# Altium schematic sheet [3] CAN, CENR-50M, Flow, Relays, LEDs.SchDoc
size A2; DocumentNumber: 6; SheetNumber: 6; SheetTotal: 10
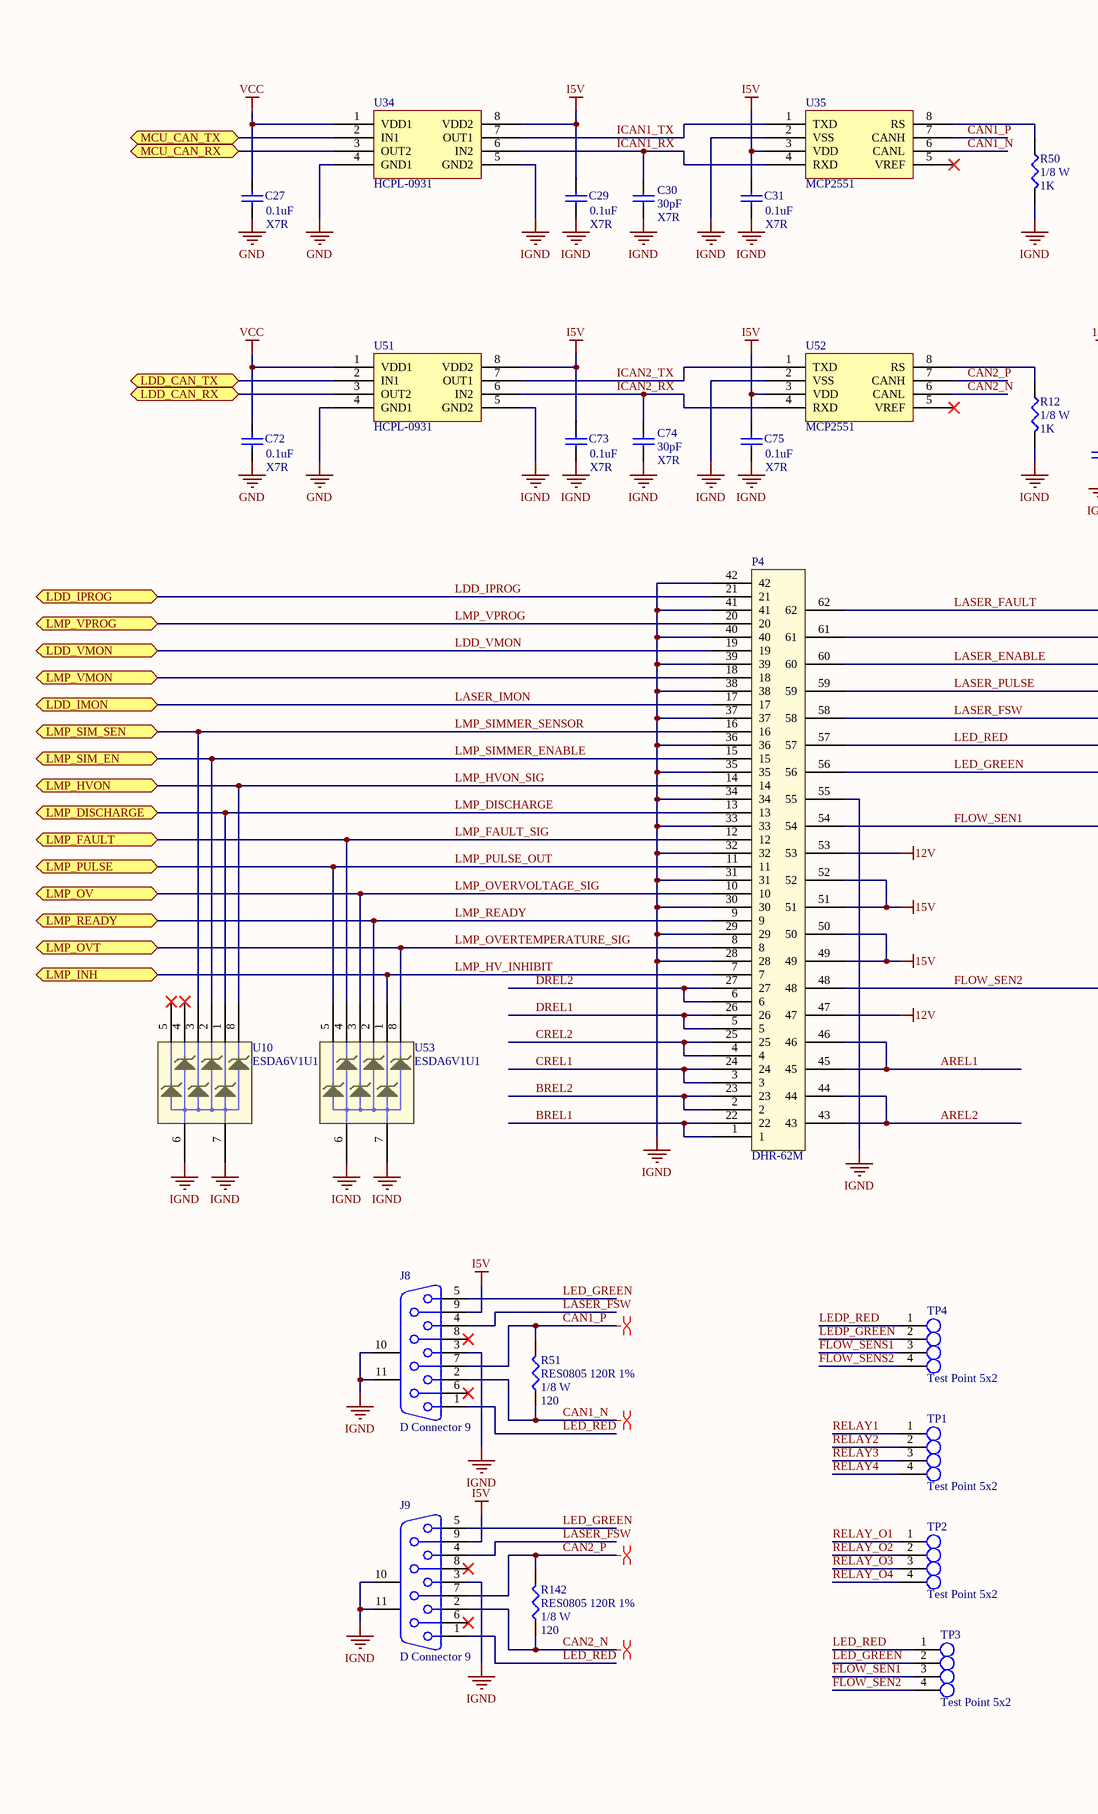
[diagram p0: [3] CAN, CENR-50M, Flow, Relays, LEDs.SchDoc, left]
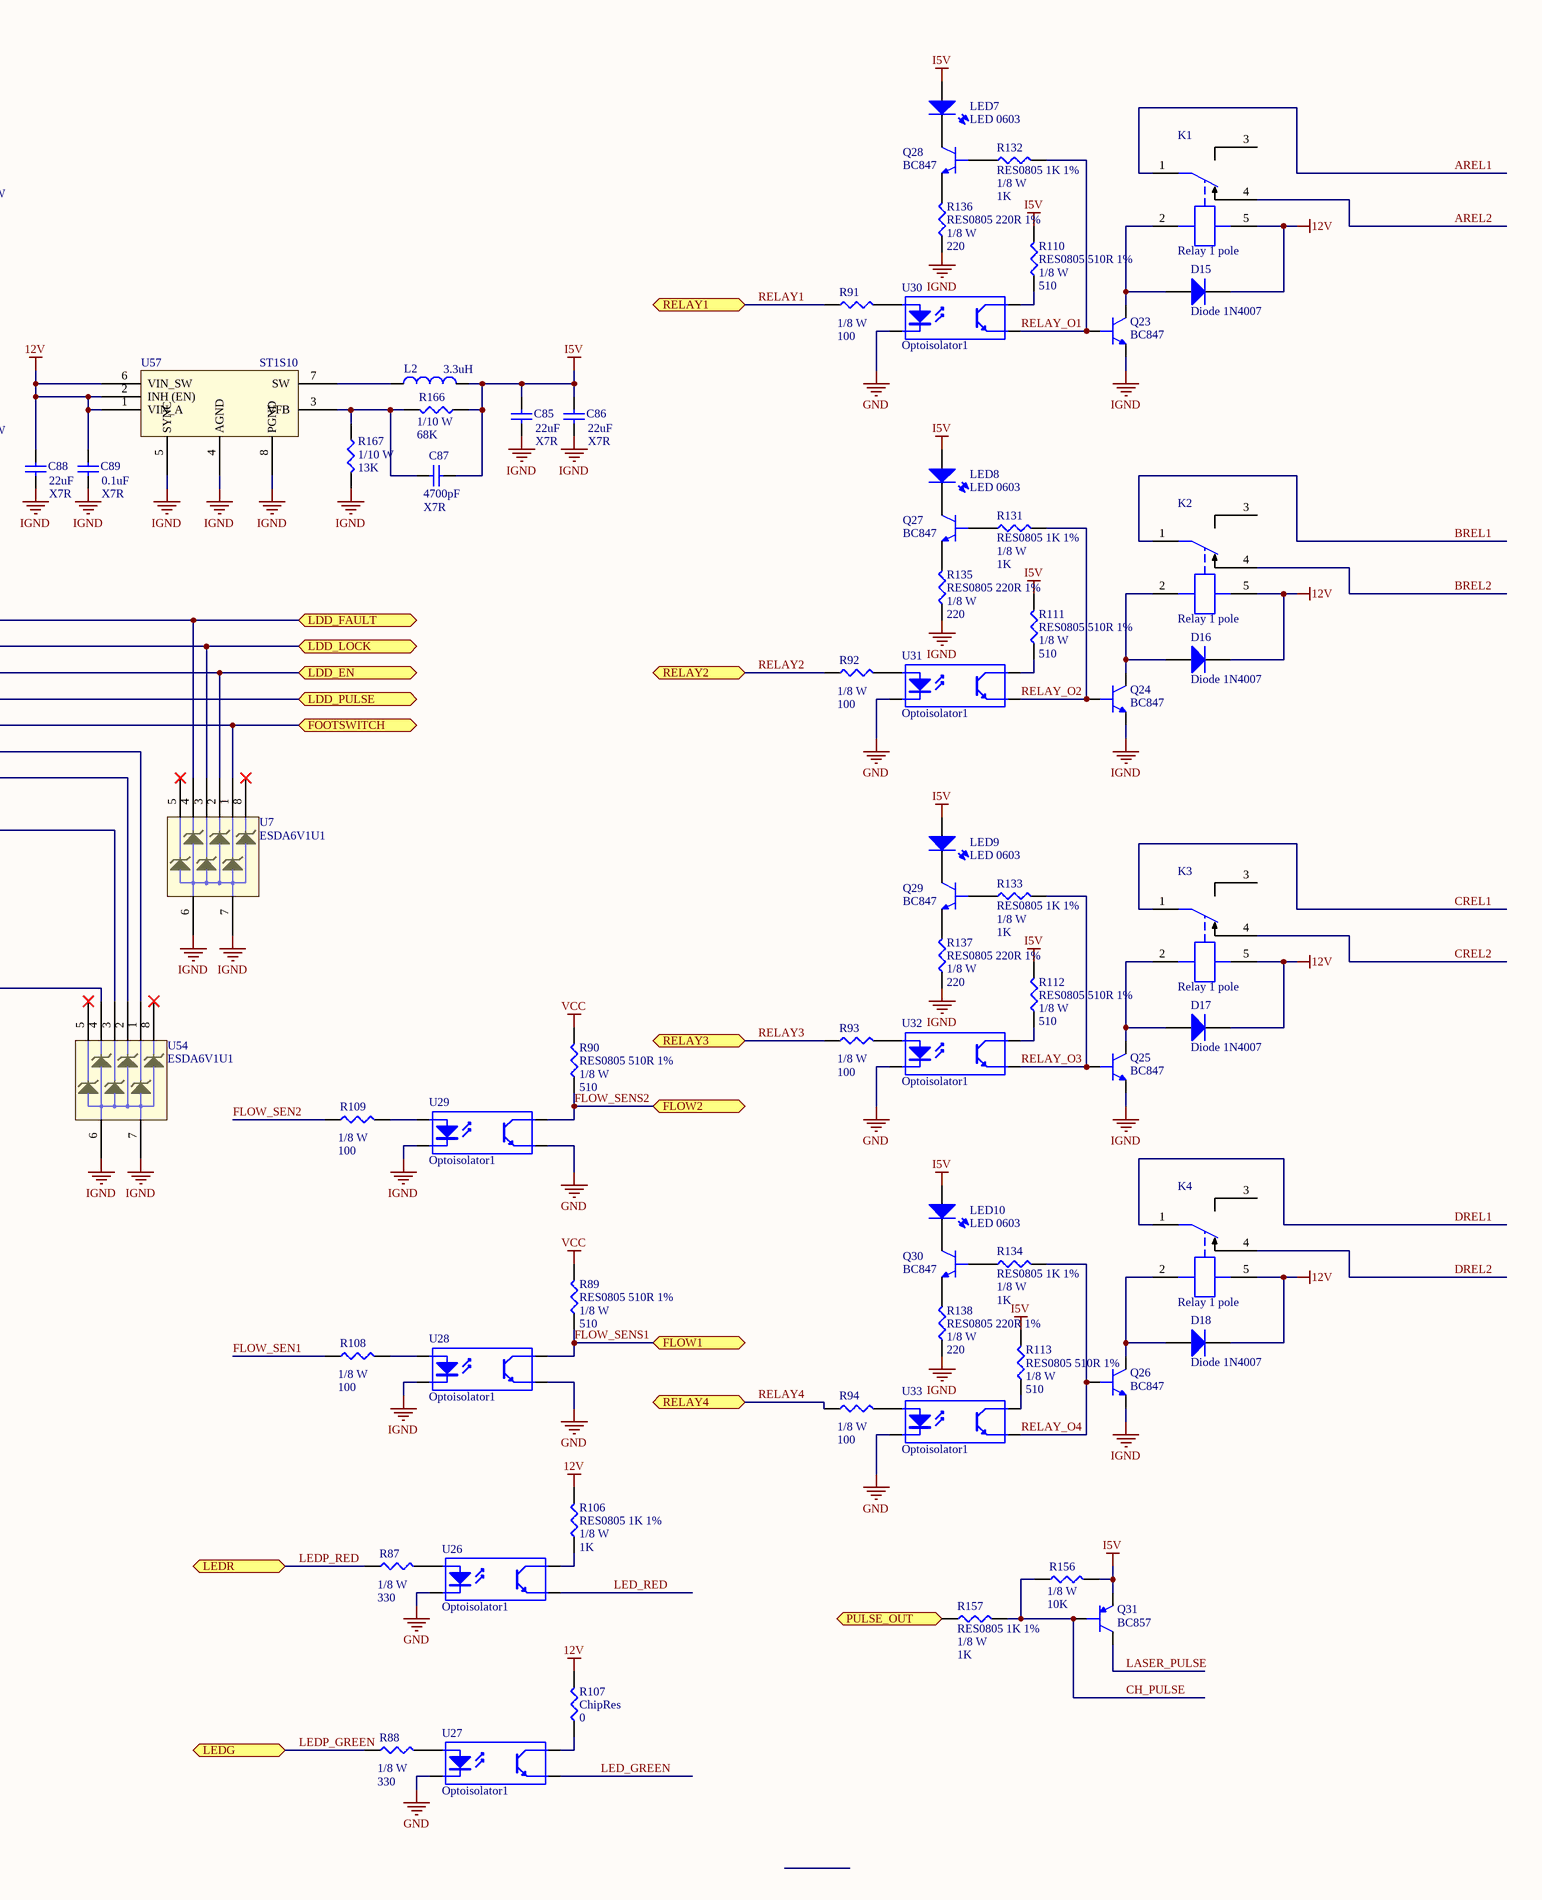
[diagram p1: [3] CAN, CENR-50M, Flow, Relays, LEDs.SchDoc, right]

## Parts
C27  value 0.1uF  Type: X7R  [CAP0805]  (hidden comment: CAP0805 0.1uF X7R)
C29  value 0.1uF  Type: X7R  [CAP0805]  (hidden comment: CAP0805 0.1uF X7R)
C30  value 30pF  Type: X7R  [CAP0805]  (hidden comment: CAP0805 30pF X7R)
C31  value 0.1uF  Type: X7R  [CAP0805]  (hidden comment: CAP0805 0.1uF X7R)
C72  value 0.1uF  Type: X7R  [CAP0805]  (hidden comment: CAP0805 0.1uF X7R)
C73  value 0.1uF  Type: X7R  [CAP0805]  (hidden comment: CAP0805 0.1uF X7R)
C74  value 30pF  Type: X7R  [CAP0805]  (hidden comment: CAP0805 30pF X7R)
C75  value 0.1uF  Type: X7R  [CAP0805]  (hidden comment: CAP0805 0.1uF X7R)
C85  value 22uF  Type: X7R  [CAP1210]  (hidden comment: ChipCap 22u X7R)
C86  value 22uF  Type: X7R  [CAP1210]  (hidden comment: ChipCap 22u X7R)
C87  value 4700pF  Type: X7R  [CAP0603]  (hidden comment: ChipCap 4700 X7R)
C88  value 22uF  Type: X7R  [CAP1210]  (hidden comment: ChipCap 22u X7R)
C89  value 0.1uF  Type: X7R  [CAP0603]  (hidden comment: ChipCap 0.1u X7R)
D15  Diode 1N4007  [DO-41]
D16  Diode 1N4007  [DO-41]
D17  Diode 1N4007  [DO-41]
D18  Diode 1N4007  [DO-41]
J8  D Connector 9  [DSUB1.385-2H9F]
J9  D Connector 9  [DSUB1.385-2H9F]
K1  Relay 1 pole  [G5LA]
K2  Relay 1 pole  [G5LA]
K3  Relay 1 pole  [G5LA]
K4  Relay 1 pole  [G5LA]
L2  value 3.3uH  [SDR0403]  (hidden comment: Inductance)
LED7  LED 0603  [LED 0603]
LED8  LED 0603  [LED 0603]
LED9  LED 0603  [LED 0603]
LED10  LED 0603  [LED 0603]
P4  DHR-62M  [DHR-62M]
Q23  BC847  [SOT23]
Q24  BC847  [SOT23]
Q25  BC847  [SOT23]
Q26  BC847  [SOT23]
Q27  BC847  [SOT23]
Q28  BC847  [SOT23]
Q29  BC847  [SOT23]
Q30  BC847  [SOT23]
Q31  BC857  [SOT23]
R12  value 1K  Rating: 1/8 W  [RES0805]  (hidden comment: RES0805 1K 1%)
R50  value 1K  Rating: 1/8 W  [RES0805]  (hidden comment: RES0805 1K 1%)
R51  RES0805 120R 1%  value 120  Rating: 1/8 W  [RES0805]
R87  value 330  Rating: 1/8 W  [RES0805]  (hidden comment: RES0805 330R 1%)
R88  value 330  Rating: 1/8 W  [RES0805]  (hidden comment: RES0805 330R 1%)
R89  RES0805 510R 1%  value 510  Rating: 1/8 W  [RES0805]
R90  RES0805 510R 1%  value 510  Rating: 1/8 W  [RES0805]
R91  value 100  Rating: 1/8 W  [RES0805]  (hidden comment: RES0805 100R 1%)
R92  value 100  Rating: 1/8 W  [RES0805]  (hidden comment: RES0805 100R 1%)
R93  value 100  Rating: 1/8 W  [RES0805]  (hidden comment: RES0805 100R 1%)
R94  value 100  Rating: 1/8 W  [RES0805]  (hidden comment: RES0805 100R 1%)
R106  RES0805 1K 1%  value 1K  Rating: 1/8 W  [RES0805]
R107  ChipRes  value 0  [RES0805]
R108  value 100  Rating: 1/8 W  [RES0805]  (hidden comment: RES0805 100R 1%)
R109  value 100  Rating: 1/8 W  [RES0805]  (hidden comment: RES0805 100R 1%)
R110  RES0805 510R 1%  value 510  Rating: 1/8 W  [RES0805]
R111  RES0805 510R 1%  value 510  Rating: 1/8 W  [RES0805]
R112  RES0805 510R 1%  value 510  Rating: 1/8 W  [RES0805]
R113  RES0805 510R 1%  value 510  Rating: 1/8 W  [RES0805]
R131  RES0805 1K 1%  value 1K  Rating: 1/8 W  [RES0805]
R132  RES0805 1K 1%  value 1K  Rating: 1/8 W  [RES0805]
R133  RES0805 1K 1%  value 1K  Rating: 1/8 W  [RES0805]
R134  RES0805 1K 1%  value 1K  Rating: 1/8 W  [RES0805]
R135  RES0805 220R 1%  value 220  Rating: 1/8 W  [RES0805]
R136  RES0805 220R 1%  value 220  Rating: 1/8 W  [RES0805]
R137  RES0805 220R 1%  value 220  Rating: 1/8 W  [RES0805]
R138  RES0805 220R 1%  value 220  Rating: 1/8 W  [RES0805]
R142  RES0805 120R 1%  value 120  Rating: 1/8 W  [RES0805]
R156  value 10K  Rating: 1/8 W  [RES0805]  (hidden comment: RES0805 10K 1%)
R157  RES0805 1K 1%  value 1K  Rating: 1/8 W  [RES0805]
R166  value 68K  Rating: 1/10 W  [RES0603]  (hidden comment: ChipRes 68K 1%)
R167  value 13K  Rating: 1/10 W  [RES0603]  (hidden comment: ChipRes 13K 1%)
TP1  Test Point 5x2  [PG-1.5-13.5-4P-2.54PH]
TP2  Test Point 5x2  [PG-1.5-13.5-4P-2.54PH]
TP3  Test Point 5x2  [PG-1.5-13.5-4P-2.54PH]
TP4  Test Point 5x2  [PG-1.5-13.5-4P-2.54PH]
U7  ESDA6V1U1  [SOP8]
U10  ESDA6V1U1  [SOP8]
U26  Optoisolator1  [DIP-4]
U27  Optoisolator1  [DIP-4]
U28  Optoisolator1  [DIP-4]
U29  Optoisolator1  [DIP-4]
U30  Optoisolator1  [DIP-4]
U31  Optoisolator1  [DIP-4]
U32  Optoisolator1  [DIP-4]
U33  Optoisolator1  [DIP-4]
U34  HCPL-0931  [SOIC8]
U35  MCP2551  [SOIC8]
U51  HCPL-0931  [SOIC8]
U52  MCP2551  [SOIC8]
U53  ESDA6V1U1  [SOP8]
U54  ESDA6V1U1  [SOP8]
U57  ST1S10  [SOIC8]

## Ports
FLOW1, FLOW2, FOOTSWITCH, LDD_CAN_RX, LDD_CAN_TX, LDD_EN, LDD_FAULT, LDD_IMON, LDD_IPROG, LDD_LOCK, LDD_PULSE, LDD_VMON, LEDG, LEDR, LMP_DISCHARGE, LMP_FAULT, LMP_HVON, LMP_INH, LMP_OV, LMP_OVT, LMP_PULSE, LMP_READY, LMP_SIM_EN, LMP_SIM_SEN, LMP_VMON, LMP_VPROG, MCU_CAN_RX, MCU_CAN_TX, PULSE_OUT, RELAY1, RELAY2, RELAY3, RELAY4

## Nets
12V: C88.2 C89.2 D15.2(K) D16.2(K) D17.2(K) D18.2(K) K1.5 K2.5 K3.5 K4.5 P4.47 P4.53 R106.2 R107.2 U57.1(VIN_A) U57.2(INH_(EN)) U57.6(VIN_SW)
15V: P4.49 P4.50 P4.51 P4.52
GND: C27.1 C72.1 U26.2(K) U27.2(K) U28.3(E) U29.3(E) U30.2(K) U31.2(K) U32.2(K) U33.2(K) U34.4(GND1) U51.4(GND1)
I5V: C29.2 C31.2 C73.2 C75.2 C85.2 C86.2 C87.2 J8.9 J9.9 L2.1 LED7.2 LED8.2 LED9.2 LED10.2 Q31.2 R110.2 R111.2 R112.2 R113.2 R156.2 R166.1 U34.8(VDD2) U35.3(VDD) U51.8(VDD2) U52.3(VDD)
IGND: C29.1 C30.1 C31.1 C73.1 C74.1 C75.1 C85.1 C86.1 C88.1 C89.1 J8.3 J8.10(MH1) J8.11(MH2) J9.3 J9.10(MH1) J9.11(MH2) P4.28 P4.29 P4.30 P4.31 P4.32 P4.33 P4.34 P4.35 P4.36 P4.37 P4.38 P4.39 P4.40 P4.41 P4.42 P4.55 Q23.2 Q24.2 Q25.2 Q26.2 R12.2 R50.2 R135.1 R136.1 R137.1 R138.1 R167.2 U7.6 U7.7 U10.6 U10.7 U28.2(K) U29.2(K) U34.5(GND2) U35.2(VSS) U51.5(GND2) U52.2(VSS) U53.6 U53.7 U54.6 U54.7 U57.4(AGND) U57.5(SYNC) U57.8(PGND)
VCC: C27.2 C72.2 R89.2 R90.2 U34.1(VDD1) U51.1(VDD1)
AREL1: K1.1 P4.45 P4.46
AREL2: K1.4 P4.43 P4.44
BREL1: K2.1 P4.1 P4.22
BREL2: K2.4 P4.2 P4.23
CAN1_N: J8.2 R51.1 U35.6(CANL)
CAN1_P: J8.7 R51.2 U35.7(CANH)
CAN2_N: J9.2 R142.1 U52.6(CANL)
CAN2_P: J9.7 R142.2 U52.7(CANH)
CH_PULSE: Q31.1 R156.1 R157.2
CREL1: K3.1 P4.3 P4.24
CREL2: K3.4 P4.4 P4.25
DREL1: K4.1 P4.5 P4.26
DREL2: K4.4 P4.6 P4.27
FLOW_SEN1: P4.54 R108.1 TP3.3 U54.3
FLOW_SEN2: P4.48 R109.1 TP3.4 U54.4
FLOW_SENS1: R89.1 TP4.3 U28.4(C) ; port FLOW1
FLOW_SENS2: R90.1 TP4.4 U29.4(C) ; port FLOW2
ICAN1_RX: C30.2 U34.6(IN2) U35.4(RXD)
ICAN1_TX: U34.7(OUT1) U35.1(TXD)
ICAN2_RX: C74.2 U51.6(IN2) U52.4(RXD)
ICAN2_TX: U51.7(OUT1) U52.1(TXD)
LASER_ENABLE: P4.60 U7.2 ; port LDD_EN
LASER_FAULT: P4.62 U7.4 ; port LDD_FAULT
LASER_FSW: J8.4 J9.4 P4.58 U7.1 ; port FOOTSWITCH
LASER_IMON: P4.17 ; port LDD_IMON
LASER_PULSE: P4.59 Q31.3 ; port LDD_PULSE
LDD_CAN_RX: U51.3(OUT2) ; port LDD_CAN_RX
LDD_CAN_TX: U51.2(IN1) ; port LDD_CAN_TX
LDD_IPROG: P4.21 ; port LDD_IPROG
LDD_LOCK: P4.61 U7.3 ; port LDD_LOCK
LDD_VMON: P4.19 ; port LDD_VMON
LED_GREEN: J8.5 J9.5 P4.56 TP3.2 U27.3(E) U54.2
LED_RED: J8.1 J9.1 P4.57 TP3.1 U26.3(E) U54.1
LEDP_GREEN: R88.1 TP4.2 ; port LEDG
LEDP_RED: R87.1 TP4.1 ; port LEDR
LMP_DISCHARGE: P4.13 U10.1 ; port LMP_DISCHARGE
LMP_FAULT_SIG: P4.12 U53.4 ; port LMP_FAULT
LMP_HV_INHIBIT: P4.7 U53.1 ; port LMP_INH
LMP_HVON_SIG: P4.14 U10.8 ; port LMP_HVON
LMP_OVERTEMPERATURE_SIG: P4.8 U53.8 ; port LMP_OVT
LMP_OVERVOLTAGE_SIG: P4.10 U53.3 ; port LMP_OV
LMP_PULSE_OUT: P4.11 U53.5 ; port LMP_PULSE
LMP_READY: P4.9 U53.2 ; port LMP_READY
LMP_SIMMER_ENABLE: P4.15 U10.2 ; port LMP_SIM_EN
LMP_SIMMER_SENSOR: P4.16 U10.3 ; port LMP_SIM_SEN
LMP_VMON: P4.18 ; port LMP_VMON
LMP_VPROG: P4.20 ; port LMP_VPROG
MCU_CAN_RX: U34.3(OUT2) ; port MCU_CAN_RX
MCU_CAN_TX: U34.2(IN1) ; port MCU_CAN_TX
PULSE_OUT: R157.1 ; port PULSE_OUT
RELAY1: R91.1 TP1.1 ; port RELAY1
RELAY2: R92.1 TP1.2 ; port RELAY2
RELAY3: R93.1 TP1.3 ; port RELAY3
RELAY4: R94.1 TP1.4 ; port RELAY4
RELAY_O1: Q23.1 R132.2 TP2.1 U30.3(E)
RELAY_O2: Q24.1 R131.2 TP2.2 U31.3(E)
RELAY_O3: Q25.1 R133.2 TP2.3 U32.3(E)
RELAY_O4: Q26.1 R134.2 TP2.4 U33.3(E)
NetC87_1: C87.1 R166.2 R167.1 U57.3(VFB)
NetD15_1: D15.1(A) K1.2 Q23.3
NetD16_1: D16.1(A) K2.2 Q24.3
NetD17_1: D17.1(A) K3.2 Q25.3
NetD18_1: D18.1(A) K4.2 Q26.3
NetL2_2: L2.2 U57.7(SW)
NetLED7_1: LED7.1 Q28.3
NetLED8_1: LED8.1 Q27.3
NetLED9_1: LED9.1 Q29.3
NetLED10_1: LED10.1 Q30.3
NetQ27_1: Q27.1 R131.1
NetQ27_2: Q27.2 R135.2
NetQ28_1: Q28.1 R132.1
NetQ28_2: Q28.2 R136.2
NetQ29_1: Q29.1 R133.1
NetQ29_2: Q29.2 R137.2
NetQ30_1: Q30.1 R134.1
NetQ30_2: Q30.2 R138.2
NetR12_1: R12.1 U52.8(RS)
NetR50_1: R50.1 U35.8(RS)
NetR87_2: R87.2 U26.1(A)
NetR88_2: R88.2 U27.1(A)
NetR91_2: R91.2 U30.1(A)
NetR92_2: R92.2 U31.1(A)
NetR93_2: R93.2 U32.1(A)
NetR94_2: R94.2 U33.1(A)
NetR106_1: R106.1 U26.4(C)
NetR107_1: R107.1 U27.4(C)
NetR108_2: R108.2 U28.1(A)
NetR109_2: R109.2 U29.1(A)
NetR110_1: R110.1 U30.4(C)
NetR111_1: R111.1 U31.4(C)
NetR112_1: R112.1 U32.4(C)
NetR113_1: R113.1 U33.4(C)

Not connected (* = marked no-connect by the designer): J8 6* 8*; J9 6* 8*; K1 3; K2 3; K3 3; K4 3; U7 5* 8*; U10 4* 5*; U35 5(VREF)*; U52 5(VREF)*; U54 5* 8*

## Layout directives
differential pair: CAN1_N, CAN1_P, CAN2_N, CAN2_P

## Library data of the parts
C27 C29 C31 C72 C73 C75 = CAP0805 0.1uF X7R: Surface-mount ceramic multilayer capacitor; Manufacturer: YAGEO; Manufacturer Part Number: CC0805JRX7R9BB104; Voltage: 50V; Tolerance: 5%; ComponentLink1Description: Datasheet; ComponentLink1URL: http://www.deaha.com/pdf/YAGEO-CC_series.pdf
C30 C74 = CAP0805 30pF X7R: Surface-mount ceramic multilayer capacitor; Manufacturer: YAGEO; Manufacturer Part Number: CC0805JRNPO9BN300; Voltage: 50V; Tolerance: 5%; ComponentLink1Description: Datasheet; ComponentLink1URL: http://www.deaha.com/pdf/YAGEO-CC_series.pdf
C85 C86 C88 = ChipCap 22uF X7R: Surface-mount ceramic multilayer capacitor; Manufacturer: YAGEO; Voltage: 25V; Tolerance: 10%; ComponentLink1Description: Datasheet; ComponentLink1URL: http://www.deaha.com/pdf/YAGEO-CC_series.pdf
C87 = ChipCap 4700 X7R: Surface-mount ceramic multilayer capacitor; Manufacturer: YAGEO; Voltage: 16V; Tolerance: 10%; ComponentLink1Description: Datasheet; ComponentLink1URL: http://www.deaha.com/pdf/YAGEO-CC_series.pdf
C89 = ChipCap 0.1uF X7R: Surface-mount ceramic multilayer capacitor; Manufacturer: YAGEO; Voltage: 100V; Tolerance: 10%; ComponentLink1Description: Datasheet; ComponentLink1URL: http://www.deaha.com/pdf/YAGEO-CC_series.pdf
D15-D18 = Diode 1N4007: 1 Amp General Purpose Rectifier; Published: 8-Jun-2000; LatestRevisionDate: 17-Jul-2002; LatestRevisionNote: Re-released for DXP Platform.; DatasheetVersion: 1998; PackageVersion: Aug-1999; PackageReference: DO-41; Publisher: Altium Limited; PackageDescription: Diode, Axial; Body 5.2 x 2.7 mm (LxDia. max), Lead Dia. 0.86 mm (max); Code_JEDEC: DO-204-AL; ComponentLink1Description: Manufacturer Link; ComponentLink1URL: http://www.fairchildsemi.com/; ComponentLink2Description: Datasheet; ComponentLink2URL: http://www.fairchildsemi.com/ds/1N%2F1N4001.pdf; Manufacturer Part Number: 1N4007
J8 J9 = D Connector 9: Receptacle Assembly, 9 Position, Right Angle; Manufacturer Part Number: DRB-9FA; Manufacturer: CONNFLY; PackageDocument: O; Positions: 9; Published: 15-Jun-2001; LatestRevisionDate: 17-Jul-2002; LatestRevisionNote: Re-released for DXP Platform.; DatasheetDocument: 1-Sep-1999; PackageReference: 788750; Publisher: Altium Limited; Orientation: Right Angle; Gender: Receptacle
K1-K4 = Relay G5LE: Relay G5LE 10A Single Pole
L2 = ChipInductance: Category: Inductance
LED7-LED10 = LED0603
P4 = DHR-62M: Dsub 62 Mail; Manufacturer Part Number: DS1038-62MBNSIA74; Manufacturer: CONNFLY; Pin Max Current: 5A
Q23-Q30 = BC847: NPN transistor; Manufacturer: ONS; Manufacturer Part Number: BC847BLT1G
Q31 = BC857: PNP Transistor; Manufacturer: NXP; Manufacturer Part Number: BC857A.215
R12 R50 R106 R131-R134 R157 = RES0805 1K 1%: Think Film Chip resistor; Manufacturer Part Number: RC0805FR-071KL; Temperature Coefficient: 100ppm/K; Tolerance: 1%; Type: ThickFilm
R51 R142 = RES0805 120R 1%: Think Film Chip resistor; Manufacturer Part Number: RC0805FR-07120RL; Temperature Coefficient: 100ppm/K; Tolerance: 1%; Type: ThickFilm
R87 R88 = RES0805 330R 1%: Think Film Chip resistor; Manufacturer Part Number: RC0805FR-07330RL; Temperature Coefficient: 100ppm/K; Tolerance: 1%; Type: ThickFilm
R89 R90 R110-R113 = RES0805 510R 1%: Think Film Chip resistor; Manufacturer Part Number: RC0805FR-07510RL; Temperature Coefficient: 100ppm/K; Tolerance: 1%; Type: ThickFilm
R91-R94 R108 R109 = RES0805 100R 1%: Think Film Chip resistor; Manufacturer Part Number: RC0805FR-07100RL; Temperature Coefficient: 100ppm/K; Tolerance: 1%; Type: ThickFilm
R107 = ChipRes: Chip resistor
R135-R138 = RES0805 220R 1%: Think Film Chip resistor; Manufacturer Part Number: RC0805JR-07220R; Temperature Coefficient: 100ppm/K; Tolerance: 1%; Type: ThickFilm
R156 = RES0805 10K 1%: Think Film Chip resistor; Manufacturer Part Number: RC0805FR-0710KL; Temperature Coefficient: 100ppm/K; Tolerance: 1%; Type: ThickFilm
R166 R167 = ChipRes 1K5 1%: Think Film Chip resistor; Temperature Coefficient: 200ppm/K; Tolerance: 1%; Type: ThickFilm
TP1-TP4 = PG-1.5-13.5-4P-2.54PH
U7 U10 U53 U54 = ESDA6V1U1: Transil Array for ESD protection; Complies with: IEC61000-4-2 : level 4; ESD Protection Level: 25 kV; Peak pulse power: 200W; Manufacturer Part Number: ESDA6V1U1
U26-U33 = Optoisolator1: 4-Pin Phototransistor Optocoupler; Published: 24-Mar-1999; LatestRevisionDate: 04-Mar-2005; LatestRevisionNote: Sch pins 3 & 4 Swapped.; DatasheetVersion: Nov-2003; PackageReference: DIP-4; Publisher: Altium Limited
U34 U51 = HCPL-0931-000E: 2-bit bi-direction optoisolated buffer
U35 U52 = MCP2551-I/SN: CAN Transceiver
U57 = ST1S10: 3 A, 900 kHz, monolithic synchronous step-down regulator IC; Manufacturer: ST; Manufacturer ID: ST1S10PHR